# EAGLE schematic Schematic_V0.5_v18 (EAGLE 9.7.0)
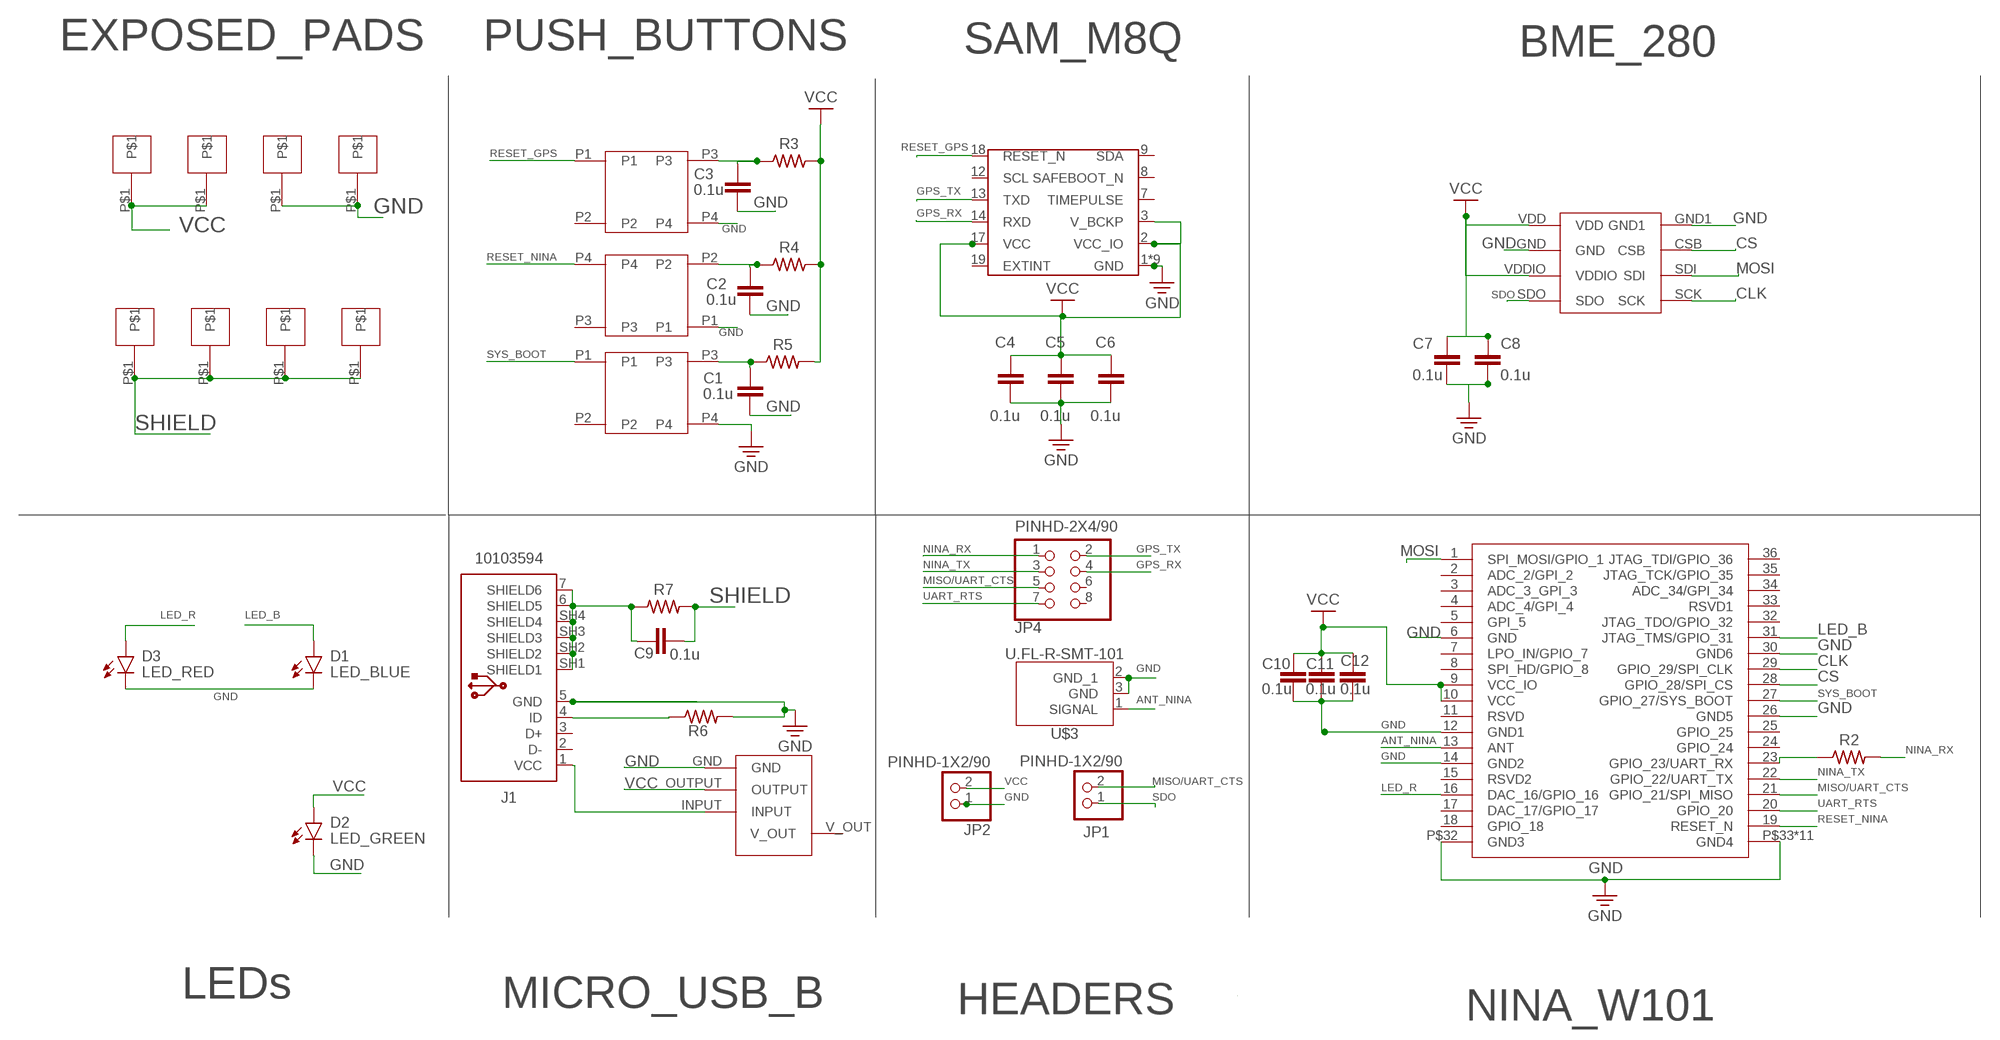
[diagram p0: schematic, sheet 1]

## Parts
C1  0.1u  C0603C100C5GACTU  [CAP_0603]
C2  0.1u  C0603C100C5GACTU  [CAP_0603]
C3  0.1u  C0603C100C5GACTU  [CAP_0603]
C4  0.1u  C0603C100C5GACTU  [CAP_0603]
C5  0.1u  C0603C100C5GACTU  [CAP_0603]
C6  0.1u  C0603C100C5GACTU  [CAP_0603]
C7  0.1u  C0603C100C5GACTU  [CAP_0603]
C8  0.1u  C0603C100C5GACTU  [CAP_0603]
C9  0.1u  C0603C100C5GACTU  [CAP_0603]
C10  0.1u  C0603C100C5GACTU  [CAP_0603]
C11  0.1u  C0603C100C5GACTU  [CAP_0603]
C12  0.1u  C0603C100C5GACTU  [CAP_0603]
D1  LED_BLUE  CHIP-ROUND-B_1209  [LEDC3224X250N_RND-B]
D2  LED_GREEN  CHIP-ROUND-G_1209  [LEDC3224X250N_RND-G]
D3  LED_RED  CHIP-ROUND-R_1209  [LEDC3224X250N_RND-R]
J1  10103594  [10103594]
JP1  PINHD-1X2/90  [1X02/90]
JP2  PINHD-1X2/90  [1X02/90]
JP4  PINHD-2X4/90  [2X04/90]
R2  500  R-US_CHIP-0603(1608-METRIC)  [RESC1608X60]
R3  10k  R-US_CHIP-0603(1608-METRIC)  [RESC1608X60]
R4  10k  R-US_CHIP-0603(1608-METRIC)  [RESC1608X60]
R5  10k  R-US_CHIP-0603(1608-METRIC)  [RESC1608X60]
R6  100K  R-US_CHIP-0603(1608-METRIC)  [RESC1608X60]
R7  10M  R-US_CHIP-0603(1608-METRIC)  [RESC1608X60]
U$1  NINA_W101  [W101]
U$2  SAM-M8Q  [SAM_M8Q]
U$3  U.FL-R-SMT-101  [U.FL-R-SMT-1(XX)]
U$4  PUSH_SWITCH  [PUSH_SWITCH]
U$5  PUSH_SWITCH  [PUSH_SWITCH]
U$6  PUSH_SWITCH  [PUSH_SWITCH]
U$7  BME_280  [BME_280]
U$8  LINEARR_VOLTAGE_REG  [LINEAR_VOLTAGE_REG]
U$9  EXPOSED_PAD  [EXPOSED_PAD]
U$10  EXPOSED_PAD  [EXPOSED_PAD]
U$11  EXPOSED_PAD  [EXPOSED_PAD]
U$12  EXPOSED_PAD  [EXPOSED_PAD]
U$13  EXPOSED_PAD  [EXPOSED_PAD]
U$14  EXPOSED_PAD  [EXPOSED_PAD]
U$15  EXPOSED_PAD  [EXPOSED_PAD]
U$16  EXPOSED_PAD  [EXPOSED_PAD]

## Nets
ANT_NINA: U$1.13(ANT) U$3.1(SIGNAL)
CLK: U$1.29(GPIO_29/SPI_CLK) U$7.SCK
CS: U$1.28(GPIO_28/SPI_CS) U$7.CSB
GND: C1.2 C2.2 C3.2 C4.2 C5.2 C6.2 C7.2 C8.2 C10.2 C11.2 C12.2 D1.C D2.C D3.C J1.5(GND) JP2.1 R6.2 U$1.6(GND) U$1.12(GND1) U$1.14(GND2) U$1.26(GND5) U$1.30(GND6) U$1.P$32(GND3) U$1.P$33(GND4) U$1.P$39(GND4) U$1.P$40(GND4) U$1.P$41(GND4) U$1.P$42(GND4) U$1.P$43(GND4) U$1.P$44(GND4) U$1.P$45(GND4) U$1.P$46(GND4) U$1.P$47(GND4) U$1.P$48(GND4) U$2.1(GND) U$2.4(GND) U$2.5(GND) U$2.6(GND) U$2.10(GND) U$2.11(GND) U$2.15(GND) U$2.16(GND) U$2.20(GND) U$3.2(GND_1) U$3.3(GND) U$4.P1 U$5.P4 U$6.P4 U$7.GND U$7.GND1 U$8.GND U$11.P$1 U$12.P$1
GPS_RX: JP4.4 U$2.14(RXD)
GPS_TX: JP4.2 U$2.13(TXD)
LED_B: D1.A U$1.31(JTAG_TMS/GPIO_31)
LED_R: D3.A U$1.16(DAC_16/GPIO_16)
MISO/UART_CTS: JP1.2 JP4.5 U$1.21(GPIO_21/SPI_MISO)
MOSI: U$1.1(SPI_MOSI/GPIO_1) U$7.SDI
N$1: R2.1 U$1.23(GPIO_23/UART_RX)
N$2: J1.1(VCC) U$8.INPUT
N$5: J1.4(ID) R6.1
N$8: C3.1 R3.1 U$6.P3
N$11: C2.1 R4.1 U$4.P2
N$12: C1.1 R5.1 U$5.P3
NINA_RX: JP4.1 R2.2
NINA_TX: JP4.3 U$1.22(GPIO_22/UART_TX)
RESET_GPS: U$2.18(RESET_N) U$6.P1
RESET_NINA: U$1.19(RESET_N) U$4.P4
SDO: JP1.1 U$7.SDO
SHIELD: C9.2 R7.2 U$13.P$1 U$14.P$1 U$15.P$1 U$16.P$1
SHIELD5: C9.1 J1.6(SHIELD5) J1.7(SHIELD6) J1.SH1(SHIELD1) J1.SH2(SHIELD2) J1.SH3(SHIELD3) J1.SH4(SHIELD4) R7.1
SYS_BOOT: U$1.27(GPIO_27/SYS_BOOT) U$5.P1
UART_RTS: JP4.7 U$1.20(GPIO_20)
VCC: C4.1 C5.1 C6.1 C7.1 C8.1 C10.1 C11.1 C12.1 D2.A JP2.2 R3.2 R4.2 R5.2 U$1.9(VCC_IO) U$1.10(VCC) U$2.2(VCC_IO) U$2.3(V_BCKP) U$2.17(VCC) U$7.VDD U$7.VDDIO U$8.OUTPUT U$9.P$1 U$10.P$1
Unconnected: J1.2(D-) J1.3(D+) JP4.6 JP4.8 U$1.2(ADC_2/GPI_2) U$1.3(ADC_3_GPI_3) U$1.4(ADC_4/GPI_4) U$1.5(GPI_5) U$1.7(LPO_IN/GPIO_7) U$1.8(SPI_HD/GPIO_8) U$1.11(RSVD) U$1.15(RSVD2) U$1.17(DAC_17/GPIO_17) U$1.18(GPIO_18) U$1.24(GPIO_24) U$1.25(GPIO_25) U$1.32(JTAG_TDO/GPIO_32) U$1.33(RSVD1) U$1.34(ADC_34/GPI_34) U$1.35(JTAG_TCK/GPIO_35) U$1.36(JTAG_TDI/GPIO_36) U$2.7(TIMEPULSE) U$2.8(SAFEBOOT_N) U$2.9(SDA) U$2.12(SCL) U$2.19(EXTINT) U$4.P3 U$5.P2 U$6.P2 U$8.V_OUT

## Notes on the sheet
- EXPOSED_PADS | PUSH_BUTTONS | SAM_M8Q | BME_280
- LEDs | MICRO_USB_B
- HEADERS | NINA_W101

## Library data of the parts
C1-C12 = Resistor_Capacitor:C0603C100C5GACTU: CAP CER 10PF 50V C0G/NP0 0603 Manufacturer's datasheet <https://content.kemet.com/datasheets/KEM_C1003_C0G_SMD.pdf>; CREATED_BY: PCBLayout.com; DIGIKEY_PART_NUMBER: 399-7814-2-ND; MANUFACTURER: KEMET; MPN: C0603C100C5GACTU; PACKAGE: SMD 0603
D1 = LED:CHIP-ROUND-B; CATEGORY: LED; COLOR: BLUE; DESCRIPTION: CHIP LED ROUND; SUB-CATEGORY: CHIP; TYPE: ROUND_TOP
D2 = LED:CHIP-ROUND-G; CATEGORY: LED; COLOR: GREEN; DESCRIPTION: CHIP LED ROUND; SUB-CATEGORY: CHIP; TYPE: ROUND_TOP
D3 = LED:CHIP-ROUND-R: LED - Generic; CATEGORY: LED; COLOR: RED; DESCRIPTION: CHIP LED ROUND; SUB-CATEGORY: CHIP; TYPE: ROUND_TOP
J1 = Connector_USB:10103594: USB(2.0) Micro-B, RCPT, 5POS, SMD-THT-R/A Datasheet <https://cdn.amphenol-icc.com/media/wysiwyg/files/documentation/datasheet/inputoutput/io_usb_micro.pdf> Drawing <https://cdn.amphenol-icc.com/media/wysiwyg/files/drawing/10103594.pdf>; CATEGORY: Connectors; CONTACTS: 5; CURRENT-RATING: 1.8A; DESCRIPTION: CONN RCPT USB2.0 MICRO B SMD R/A; GENDER: Receptacle; MANUFACTURER: Amphenol ICC (FCI); MOUNT_TYPE: R/A; MPN: 10103594-0001LF; OPERATING_TEMPERATURE: -30°C ~ 80°C; PART_STATUS: ACTIVE; ROHS_COMPLIANT: COMPLIANT; SUB_CATEGORY: USB; TYPE: USB-micro B; VOLTAGE-RATING: 100VAC
JP1 JP2 = Connector:PINHD-1X2: PIN HEADER; CATEGORY: CONNECTOR; SUB-CATEGORY: PIN-HEADER
JP4 = Connector:PINHD-2X4: PIN HEADER; CATEGORY: CONNECTOR; SUB-CATEGORY: PIN-HEADER
R2-R7 = Resistor:R-US: Resistor Fixed - ANSI; CATEGORY: Resistor; SUB-CATEGORY: Fixed
U$1 = Library:NINA_W101
U$2 = Library:SAM-M8Q
U$3 = Connector:U.FL-R-SMT-1: U.FL (UMCC) Connector Receptacle, Male Pin 50Ohm Surface Mount Solder Datasheet <https://media.digikey.com/pdf/Data%20Sheets/Hirose%20PDFs/UFL%20Series.pdf> Drawing <https://www.hirose.com/product/document?clcode=CL0331-0472-2-10&productname=U.FL-R-SMT-1(10)&series=U.FL&documenttype=2DDrawing&lang=en&documentid=0000940684>; CATEGORY: Connector; DESCRIPTION: Ultra Small Surface Mount Coaxial Connectors; MANUFACTURER: Hirose Electric Co Ltd; MPN: U.FL-R-SMT-1(01); OPERATING_TEMPERATURE: -40˚C to +90˚C; PART_STATUS: Active; ROHS_COMPLIANCE: RoHS Compliant; SERIES: U.FL; TYPE: RF Connector
U$4-U$6 = Library:PUSH_SWITCH
U$7 = Library:BME_280
U$8 = Library:LINEARR_VOLTAGE_REG
U$9-U$16 = Library:EXPOSED_PAD